# Altium schematic sheet SCH-radio.SchDoc
size A2; Organization: Altium Limited; Address1: L3, 12a Rodborough Rd; Address2: Frenchs Forest; Address3: NSW; Address4: Australia 2086
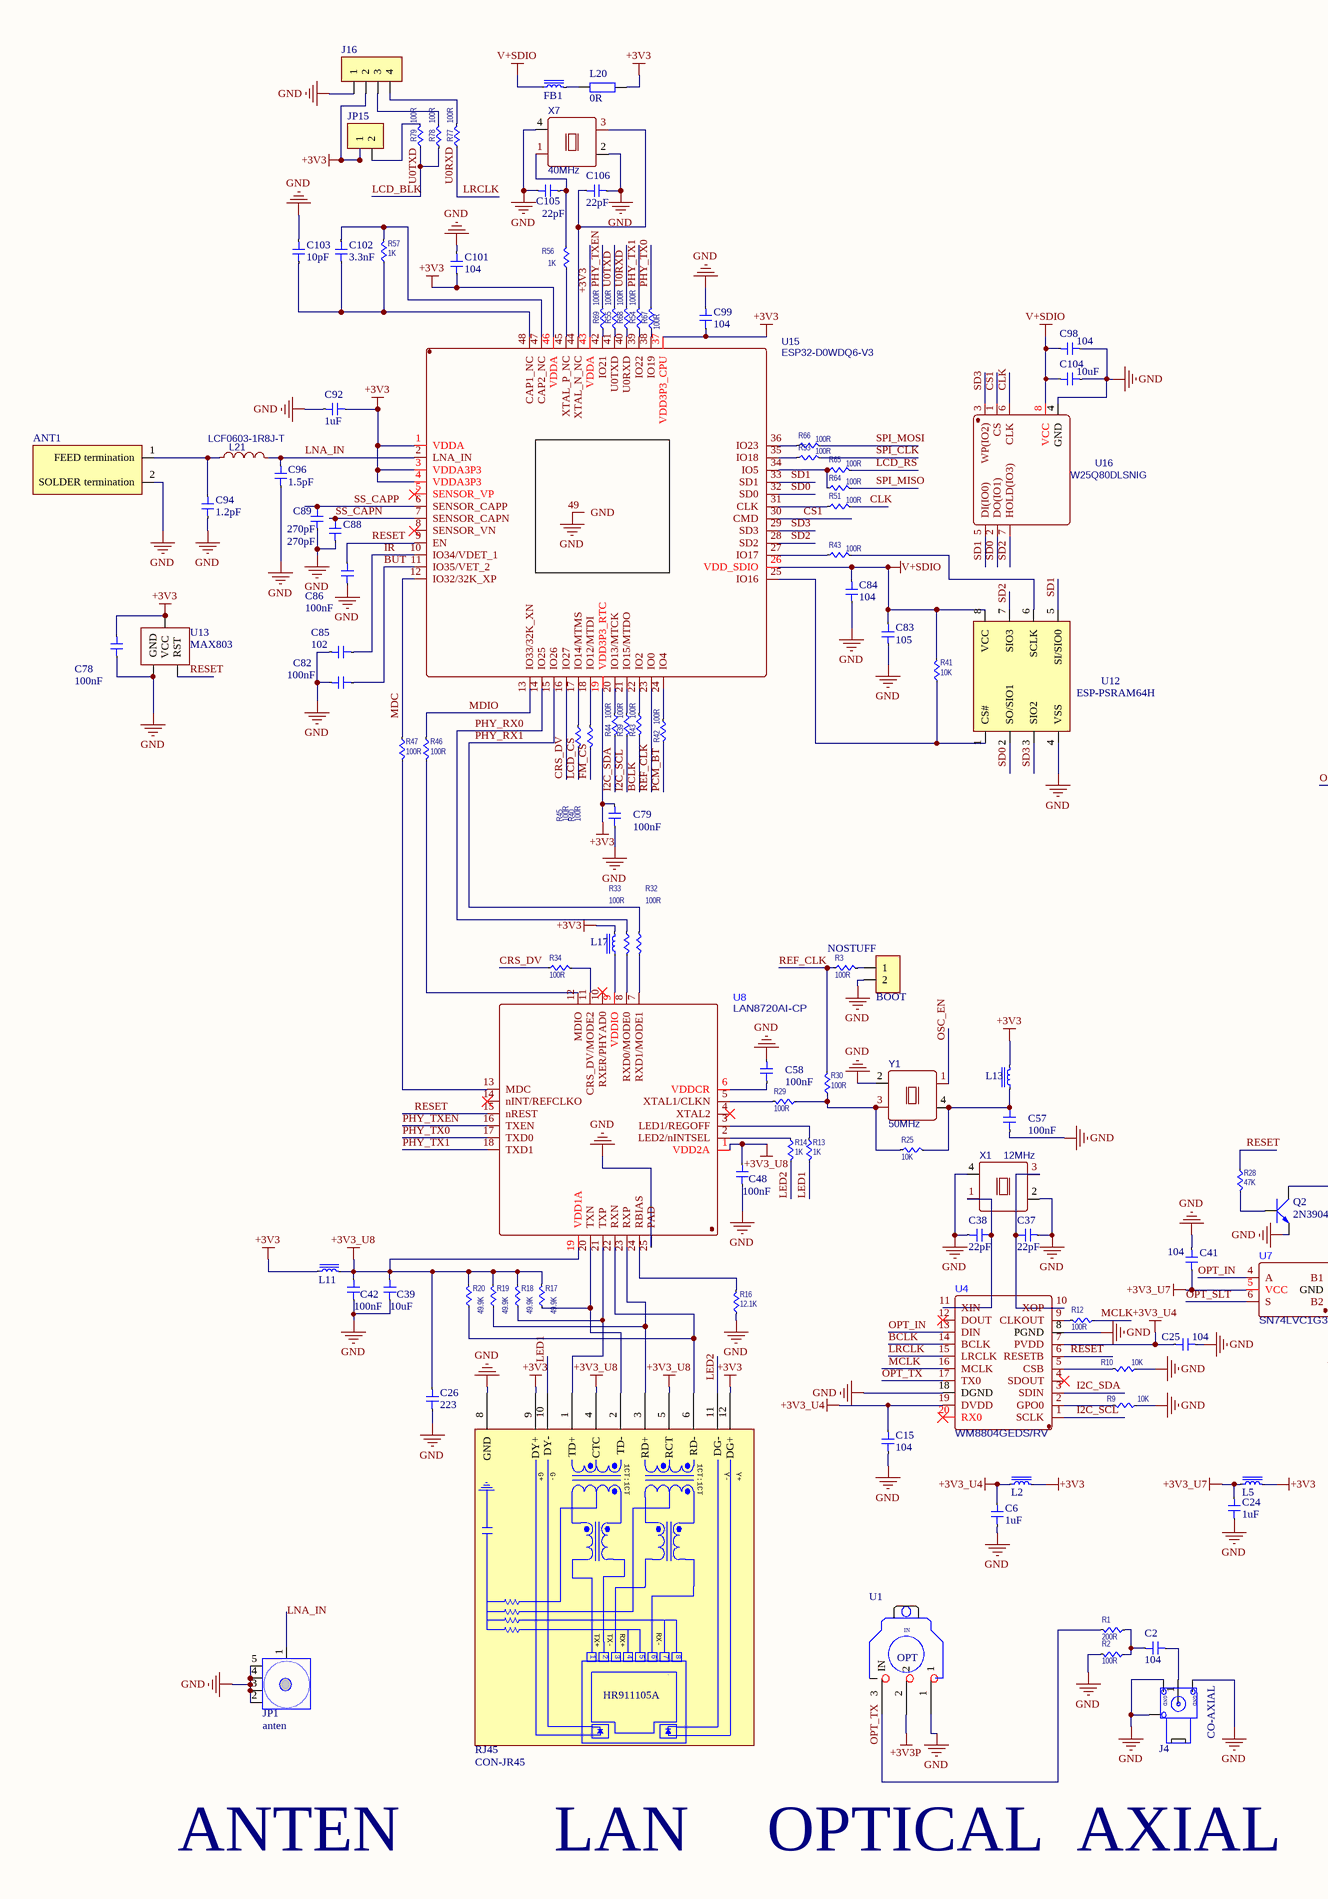
[diagram p0: SCH-radio.SchDoc, left]
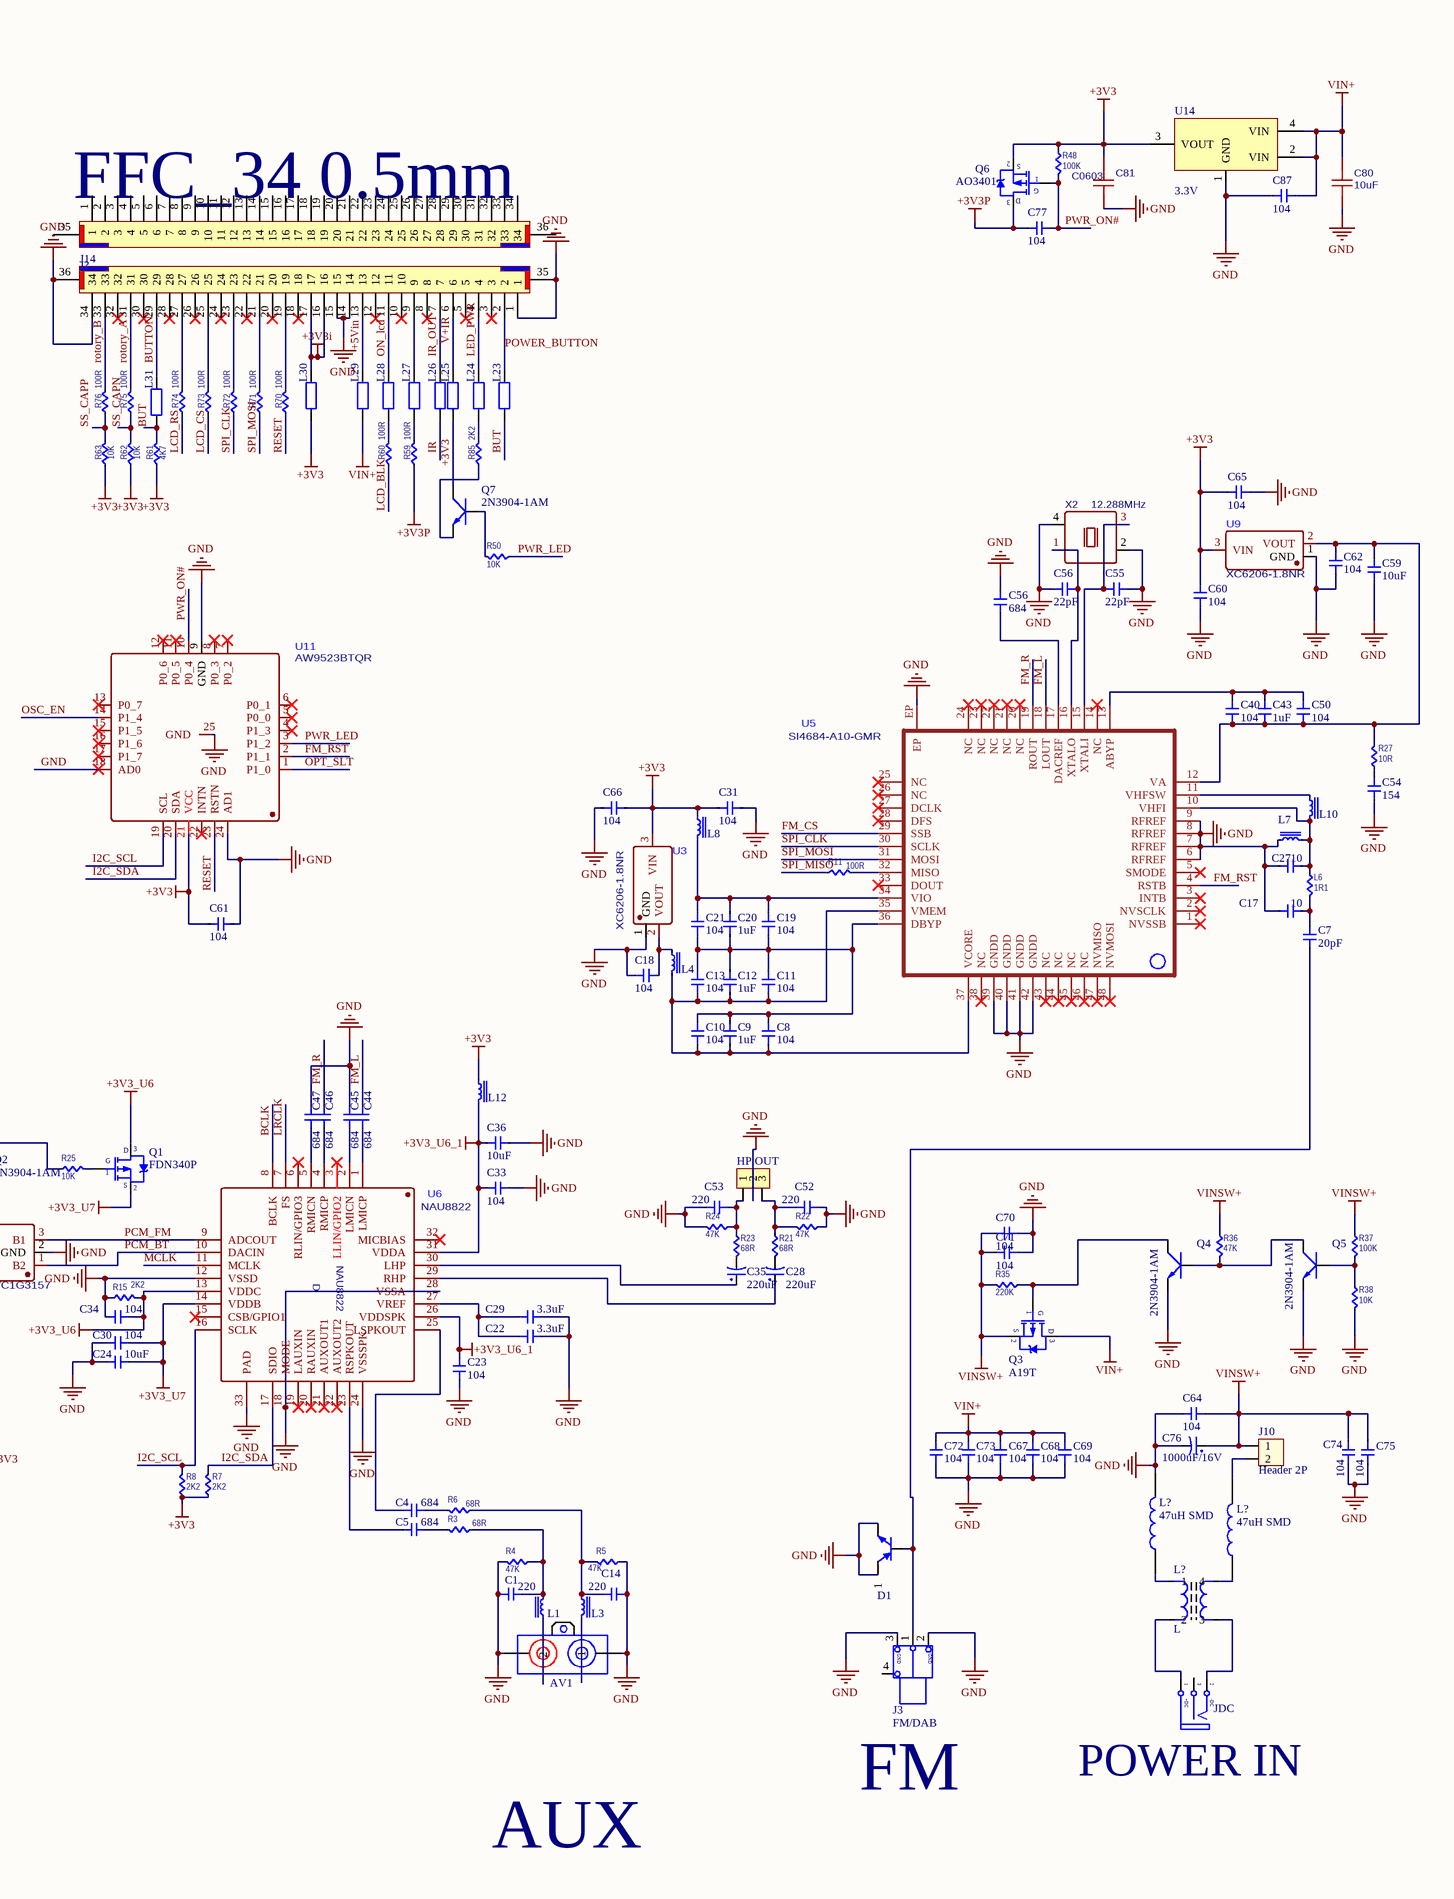
[diagram p1: SCH-radio.SchDoc, right]

## Parts
(Parts that share a designator on the sheet are numbered #1, #2 ... from top to bottom, then left to right.)
ANT1  Rainsun AN2051 2.4GHZ Chip Antenna  [ANTENNA CHIP RAINSUN 2.4GHZ AN2051]  (value not drawn)
AV1  AV2  [AV2 FELMALE DON DUNG_SLIVER NAM]  (value not drawn)
BOOT  JP2 2.54mm  [JP2-D1T]  (value not drawn)
C1  220  [CAP 0402]
C2  104  [CAP 0402]
C4  684  [CAP 0402]
C5  684  [CAP 0402]
C6  1uF  [CAP 0402]
C7  20pF  [CAP 0402]
C8  104  [CAP 0402]
C9  1uF  [CAP 0402]
C10  104  [CAP 0402]
C11  104  [CAP 0402]
C12  1uF  [CAP 0402]
C13  104  [CAP 0402]
C14  220  [CAP 0402]
C15  104  [CAP 0402]
C17  10  [CAP 0402]
C18  104  [CAP 0402]
C19  104  [CAP 0402]
C20  1uF  [CAP 0402]
C21  104  [CAP 0402]
C22  3.3uF  [CAP 0402]
C23  104  [CAP 0402]
C24#1  10uF  [CAP 0402]
C24#2  1uF  [CAP 0402]
C25  104  [CAP 0402]
C26  223  [CAP 0402]
C27  10  [CAP 0402]
C28  220uF  [tu hoa 4mm]
C29  3.3uF  [CAP 0402]
C30  104  [CAP 0402]
C31  104  [CAP 0402]
C33  104  [CAP 0402]
C34  104  [CAP 0402]
C35  220uF  [tu hoa 4mm]
C36  10uF  [CAP 0402]
C37  22pF  [CAP 0402]
C38  22pF  [CAP 0402]
C39  10uF  [CAP 0402]
C40  104  [CAP 0402]
C41  104  [CAP 0402]
C42  100nF  [CAP 0402]
C43  1uF  [CAP 0402]
C44  684  [CAP 0402]
C45  684  [CAP 0402]
C46  684  [CAP 0402]
C47  684  [CAP 0402]
C48  100nF  [CAP 0402]
C50  104  [CAP 0402]
C52  220  [CAP 0402]
C53  220  [CAP 0402]
C54  154  [CAP 0402]
C55  22pF  [CAP 0402]
C56#1  684  [CAP 0402]
C56#2  22pF  [CAP 0402]
C57  100nF  [CAP 0402]
C58  100nF  [CAP 0402]
C59  10uF  [CAP 0402]
C60  104  [CAP 0402]
C61  104  [CAP 0402]
C62  104  [CAP 0402]
C64  104  [CAP 0402]
C65  104  [CAP 0402]
C66  104  [CAP 0402]
C67  104  [CAP 0402]
C68  104  [CAP 0402]
C69  104  [CAP 0402]
C70  104  [CAP 0402]
C71  104  [CAP 0402]
C72  104  [CAP 0402]
C73  104  [CAP 0402]
C74  104  [CAP 0402]
C75  104  [CAP 0402]
C76  1000uF/16V  [tu hoa 10mm]
C77  104  [CAP 0402]
C78  100nF  [CAP 0402]
C79  100nF  [CAP 0402]
C80  10uF  [Tu 0603]
C81  C0603  [Tu 0603]
C82  100nF  [CAP 0402]
C83  105  [CAP 0402]
C84  104  [CAP 0402]
C85  102  [CAP 0402]
C86  100nF  [CAP 0402]
C87  104  [CAP 0402]
C88  270pF  [CAP 0402]
C89  270pF  [CAP 0402]
C92  1uF  [CAP 0402]
C94  1.2pF  [CAP 0402]
C96  1.5pF  [CAP 0402]
C98  104  [CAP 0402]
C99  104  [CAP 0402]
C101  104  [CAP 0402]
C102  3.3nF  [CAP 0402]
C103  10pF  [CAP 0402]
C104  10uF  [CAP 0402]
C105  22pF  [CAP 0402]
C106  22pF  [CAP 0402]
D1  DIODE A7  [SOT23]  (value not drawn)
FB1  FERRITE BEAD 1 KOHM 0402 1LN  [IND 0402]  (value not drawn)
HP_OUT  XH3P-2.54mm  [XH3P-2.54mm]  (value not drawn)
J3  FM/DAB  [TRC-005]
J4  CO-AXIAL  [TRC-005]
J10  Header 2P  [Header_Duc Cong_2P 2.54 T]
J14  0.5mm 34P H  [FPC-0.5MM-34P-H2.0]  (value not drawn)
J16  JP4 2.54mm  [JP4-D1T]  (value not drawn)
J?  0.5mm 34P H  [FPC-0.5MM-34P-H2.0]  (value not drawn)
JDC  Jack DC5.5x2.1  [DC-IN]  (value not drawn)
JP1  anten  [SMA_UFL HOLE]
JP15  JP2 2.54mm  [JP2-D1T]  (value not drawn)
L1  FERRITE BEAD 1 KOHM 0402 1LN  [IND 0402]  (value not drawn)
L2  FERRITE BEAD 1 KOHM 0402 1LN  [IND 0402]  (value not drawn)
L3  FERRITE BEAD 1 KOHM 0402 1LN  [IND 0402]  (value not drawn)
L4  FERRITE BEAD 1 KOHM 0402 1LN  [IND 0402]  (value not drawn)
L5  FERRITE BEAD 1 KOHM 0402 1LN  [IND 0402]  (value not drawn)
L6  1R1  [RES 0402]
L7  FERRITE BEAD 1 KOHM 0402 1LN  [IND 0402]  (value not drawn)
L8  FERRITE BEAD 1 KOHM 0402 1LN  [IND 0402]  (value not drawn)
L10  FERRITE BEAD 1 KOHM 0402 1LN  [IND 0402]  (value not drawn)
L11  FERRITE BEAD 1 KOHM 0402 1LN  [IND 0402]  (value not drawn)
L12  FERRITE BEAD 1 KOHM 0402 1LN  [IND 0402]  (value not drawn)
L13  FERRITE BEAD 1 KOHM 0402 1LN  [IND 0402]  (value not drawn)
L17  FERRITE BEAD 1 KOHM 0402 1LN  [IND 0402]  (value not drawn)
L20  0R  [tro smd 0603]
L21  LCF0603-1R8J-T  [L 0603]
L23  mH  [tro smd 0603]  (value not drawn)
L24  mH  [tro smd 0603]  (value not drawn)
L25  mH  [tro smd 0603]  (value not drawn)
L26  mH  [tro smd 0603]  (value not drawn)
L27  mH  [tro smd 0603]  (value not drawn)
L28  mH  [tro smd 0603]  (value not drawn)
L29  mH  [tro smd 0603]  (value not drawn)
L30  mH  [tro smd 0603]  (value not drawn)
L31  mH  [tro smd 0603]  (value not drawn)
L?#1  47uH SMD  [L 1206]
L?#2  47uH SMD  [L 1206]
L?#3  L  [L 1A 7X8]
Q1  FDN340P  [SOT23 MOSFET P]
Q2  2N3904-1AM  [SOT23BCE]
Q3  A19T  [SOT23 MOSFET P]
Q4  2N3904-1AM  [SOT23BCE]
Q5  2N3904-1AM  [SOT23BCE]
Q6  AO3401  [SOT23 MOSFET P]
Q7  2N3904-1AM  [SOT23BCE]
R1  200R  [RES 0402]
R2  100R  [RES 0402]
R3#1  100R  [RES 0402]
R3#2  68R  [RES 0402]
R4  47K  [RES 0402]
R5  47K  [RES 0402]
R6  68R  [RES 0402]
R7  2K2  [RES 0402]
R8  2K2  [RES 0402]
R9  10K  [RES 0402]
R10  10K  [RES 0402]
R11  100R  [RES 0402]
R12  100R  [RES 0402]
R13  1K  [RES 0402]
R14  1K  [RES 0402]
R15  2K2  [RES 0402]
R16  12.1K  [RES 0402]
R17  49.9K  [RES 0402]
R18  49.9K  [RES 0402]
R19  49.9K  [RES 0402]
R20  49.9K  [RES 0402]
R21  68R  [RES 0402]
R22  47K  [RES 0402]
R23  68R  [RES 0402]
R24  47K  [RES 0402]
R25#1  10K  [RES 0402]
R25#2  10K  [RES 0402]
R27  10R  [RES 0402]
R28  47K  [RES 0402]
R29  100R  [RES 0402]
R30  100R  [RES 0402]
R32  100R  [RES 0402]
R33  100R  [RES 0402]
R34  100R  [RES 0402]
R35  220K  [RES 0402]
R36  47K  [RES 0402]
R37  100K  [RES 0402]
R38  10K  [RES 0402]
R39  100R  [RES 0402]
R40  100R  [RES 0402]
R41  10K  [RES 0402]
R42  100R  [RES 0402]
R43#1  100R  [RES 0402]
R43#2  100R  [RES 0402]
R44  100R  [RES 0402]
R45  100R  [RES 0402]
R46  100R  [RES 0402]
R47  100R  [RES 0402]
R48  100K  [RES 0402]
R50  10K  [RES 0402]
R51  100R  [RES 0402]
R53  100R  [RES 0402]
R54  100R  [RES 0402]
R55  100R  [RES 0402]
R56  1K  [RES 0402]
R57  1K  [RES 0402]
R59  100R  [RES 0402]
R60  100R  [RES 0402]
R61  4K7  [RES 0402]
R62  10K  [RES 0402]
R63  10K  [RES 0402]
R64  100R  [RES 0402]
R65  100R  [RES 0402]
R66  100R  [RES 0402]
R67  100R  [RES 0402]
R68  100R  [RES 0402]
R69  100R  [RES 0402]
R70  100R  [RES 0402]
R71  100R  [RES 0402]
R72  100R  [RES 0402]
R73  100R  [RES 0402]
R74  100R  [RES 0402]
R75  100R  [RES 0402]
R76  100R  [RES 0402]
R77  100R  [RES 0402]
R78  100R  [RES 0402]
R79  100R  [RES 0402]
R85  2K2  [RES 0402]
RJ45  CON-JR45  [CON JR45]
U1  OPTICAL IN  [OPTICAL TOTX147AL(F,T)]  (value not drawn)
U3  XC6206-1.8NR  [SOT-23-3_L2.9-W1.3-P0.95-LS2.4-BR]
U4  WM8804GEDS/RV  [SSOP-20_L7.2-W5.3-P0.65-LS7.8-BL]
U5  SI4684-A10-GMR  [48-VFQFN (7X7) EXPOSED PAD]
U6  NAU8822  [HVQFN-32_L5.0-W5.0-P0.50-BL-EP]
U7  SN74LVC1G3157  [SOT 23- 6]
U8  LAN8720AI-CP  [QFN24]
U9  XC6206-1.8NR  [SOT-23-3_L2.9-W1.3-P0.95-LS2.4-BR]
U11  AW9523BTQR  [TQFN-24_L4.0-W4.0-P0.50-TL-EP]
U12  ESP-PSRAM64H  [SOP-8]
U13  MAX803  [SOT23BCE]
U14  3.3V  [SOT89-150P410X160-3N]
U15  ESP32-D0WDQ6-V3  [QFN-48_L7.0-W7.0-P0.50-BL-EP5.1]
U16  W25Q80DLSNIG  [SOP-8]
X1  12MHz  [Crystal 4SMD 32x25MM]
X2  12.288MHz  [Crystal 4SMD 32x25MM]
X7  40MHz  [Crystal 4SMD 32x25MM]
Y1  50MHz  [Crystal 4SMD 32x25MM]

## Nets
+3V3: C31.1 C60.2 C61.2 C65.1 C66.2 C78.1 C79.2 C81.2 C92.2 C99.1 C101.2 J16.2 JP15.1 L2.2 L5.2 L8.1 L11.1 L12.1 L13.2 L17.2 L20.2 L25.1 L30.1 Q6.2(S) Q7.2(C) R7.1 R8.1 R48.1 R61.1 R62.1 R63.1 RJ45.9(DY+) RJ45.12(DG+) U3.3(VIN) U9.3(VIN) U11.21(VCC) U13.2(VCC) U14.3(VOUT) U15.1(VDDA) U15.3(VDDA3P3) U15.4(VDDA3P3) U15.19(VDD3P3_RTC) U15.37(VDD3P3_CPU) U15.43(VDDA) U15.46(VDDA)
+3V3_U4: C6.2 C15.2 C25.1 L2.1 U4.7(PVDD) U4.19(DVDD)
+3V3_U6: C34.1 Q1.3(D) R15.2 U6.13(VDDC)
+3V3_U6_1: C23.1 C33.2 C36.2 L12.2 U6.26(VDDSPK) U6.31(VDDA)
+3V3_U7: C24#1.1 C24#2.2 C30.1 C41.2 L5.1 Q1.2(S) U6.14(VDDB) U7.5(VCC)
+3V3_U8: C26.2 C39.2 C42.2 C48.2 L11.2 R17.2 R18.2 R19.2 R20.2 RJ45.4(CTC) RJ45.5(RCT) U8.1(VDD2A) U8.19(VDD1A)
+3V3i: J14.16 J14.17 L30.2
+3V3P: C77.2 Q6.3(D) R59.1 U1.2
GND: ANT1.2(SOLDER_termination) AV1.3 AV1.4 BOOT.2 C1.2 C6.1 C14.1 C15.1 C17.1 C18.1 C22.1 C23.2 C24#1.2 C24#2.1 C25.2 C26.1 C27.1 C29.1 C30.2 C31.2 C33.1 C34.2 C36.1 C37.1 C38.2 C39.1 C41.1 C42.1 C45.1 C47.1 C48.1 C52.1 C53.2 C54.1 C55.1 C56#1.1 C56#2.2 C57.1 C58.2 C59.1 C60.1 C61.1 C62.1 C64.2 C65.2 C66.1 C67.2 C68.2 C69.2 C70.1 C71.1 C72.2 C73.2 C74.1 C75.1 C76.2 C78.2 C79.1 C80.1 C81.1 C82.1 C83.2 C84.2 C85.1 C86.2 C87.2 C88.2 C89.2 C92.1 C94.1 C96.1 C98.2 C99.2 C101.1 C103.1 C104.2 C105.2 C106.1 D1.2(C) HP_OUT.2 J3.2(Yellow) J3.3(White) J4.2(Yellow) J4.3(White) J4.4(Red) J14.1 J14.14 J14.15 J14.34 J14.35 J14.36 J16.1 JP1.2 JP1.3 JP1.4 JP1.5 L7.1 L?#1.2 Q2.3(E) Q4.3(E) Q5.3(E) R2.2 R4.2 R5.1 R9.1 R10.1 R15.1 R16.1 R22.1 R24.2 R38.2 RJ45.8(GND) U1.1 U3.1(GND) U4.8(PGND) U4.18(DGND) U5.6(RFREF) U5.7(RFREF) U5.8(RFREF) U5.9(RFREF) U5.39(GNDD) U5.40(GNDD) U5.41(GNDD) U5.42(GNDD) U5.EP U6.12(VSSD) U6.18(MODE) U6.24(VSSSPK) U6.28(VSSA) U6.33(PAD) U7.2(GND) U8.25(PAD) U9.1(GND) U11.9(GND) U11.18(AD0) U11.24(AD1) U11.25(GND) U12.4(VSS) U13.1(GND) U14.1(GND) U15.49(GND) U16.4(GND) X1.2(GND) X1.4(VCC) X2.2(GND) X2.4(VCC) X7.2(GND) X7.4(VCC) Y1.2(GND)
V+SDIO: C83.1 C84.1 C98.1 C104.1 FB1.1 R41.2 U12.8(VCC) U15.26(VDD_SDIO) U16.8(VCC)
VIN+: C67.1 C68.1 C69.1 C72.1 C73.1 C80.2 C87.1 L29.1 Q3.3(D) U14.2(VIN) U14.4(VIN)
VINSW+: C64.1 C70.2 C71.2 C74.2 C75.2 C76.1 J10.1 Q3.2(S) R35.2 R36.1 R37.1
+5Vin: J14.13 L29.2
BCLK: R43#2.2 U4.14(BCLK) U6.8(BCLK)
BUT: C82.2 L23.1 L31.1 R61.2 U15.11(IO35/VET_2)
BUTTON: J14.29 L31.2
CLK: R51.2 U16.6(CLK)
CRS_DV: R34.1 U15.16(IO27)
CS1: U15.30(CMD) U16.1(CS)
FM_CS: R40.2 U5.29(SSB)
FM_L: C44.1 U5.18(LOUT)
FM_R: C46.1 U5.19(ROUT)
FM_RST: U5.4(RSTB) U11.2(P1_1)
I2C_SCL: R8.2 R39.2 U4.1(SCLK) U6.16(SCLK) U11.19(SCL)
I2C_SDA: R7.2 R44.2 U4.3(SDIN) U6.17(SDIO) U11.20(SDA)
IR: C85.2 L26.1 U15.10(IO34/VDET_1)
IR_OUT: J14.7 L26.2
LCD_BLK: R55.2 R60.1 R78.1 R79.1  [also labelled U0TXD]
LCD_CS: R45.2 R73.1
LCD_RS: R65.2 R74.1
LED1: R13.2 RJ45.10(DY-)
LED2: R14.2 RJ45.11(DG-)
LED_PWR: J14.4 L24.2
LNA_IN: C96.2 JP1.1 L21.2 U15.2(LNA_IN)
LRCLK: R68.2 R77.1 U4.15(LRCLK) U6.7(FS)  [also labelled U0RXD]
MCLK: R12.1 U4.16(MCLK) U6.11(MCLK)
MDC: R47.1 U15.12(IO32/32K_XP)
MDIO: R46.1 U15.13(IO33/32K_XN)
ON_lcd: J14.11 L28.2
OPT_IN: U4.13(DIN) U7.4(A)
OPT_SLT: U7.6(S) U11.1(P1_0)
OPT_TX: R1.2 U1.3(IN) U4.17(TX0)
OSC_EN: U11.14(P1_4) Y1.1(tri)
PCM_BT: R42.2 U6.10(DACIN) U7.1(B2)
PCM_FM: U6.9(ADCOUT) U7.3(B1)
PHY_RX0: R33.1 U15.14(IO25)
PHY_RX1: R32.1 U15.15(IO26)
PHY_TX0: R67.2 U8.17(TXD0)
PHY_TX1: R54.2 U8.18(TXD1)
PHY_TXEN: R69.2 U8.16(TXEN)
POWER_BUTTON: J14.2 L23.2
PWR_LED: R50.1 U11.3(P1_2)
PWR_ON#: C77.1 Q6.1(G) R48.2 U11.10(P0_4)
REF_CLK: R3#1.1 R30.2 U15.23(IO0)
RESET: C86.1 R28.1 R70.1 U4.6(RESETB) U8.15(nREST) U11.23(RSTN) U13.3(RST) U15.9(EN)
rotory_A: J14.31 R75.2
rotory_B: J14.33 R76.2
SD0: U12.2(SO/SIO1) U15.32(SD0) U16.2(DO(IO1))
SD1: U12.5(SI/SIO0) U15.33(SD1) U16.5(DI(IO0))
SD2: U12.7(SIO3) U15.28(SD2) U16.7(HOLD(IO3))
SD3: U12.3(SIO2) U15.29(SD3) U16.3(WP(IO2))
SPI_CLK: R53.2 R72.1 U5.30(SCLK)
SPI_MISO: R11.1 R64.2
SPI_MOSI: R66.2 R71.1 U5.31(MOSI)
SS_CAPN: C88.1 R62.2 R75.1 U15.7(SENSOR_CAPN)
SS_CAPP: C89.1 R63.2 R76.1 U15.6(SENSOR_CAPP)
V+IR: J14.6 L25.2
NetANT1_1: ANT1.1(FEED_termination) C94.2 L21.1
NetAV1_1: AV1.1 L3.2
NetAV1_2: AV1.2 L1.1
NetBOOT_1: BOOT.1 R3#1.2
NetC1_1: C1.1 L1.2 R3#2.1 R4.1
NetC2_1: C2.1 J4.1(Black)
NetC2_2: C2.2 R1.1 R2.1
NetC4_1: C4.1 R6.2
NetC4_2: C4.2 U6.25(LSPKOUT)
NetC5_1: C5.1 R3#2.2
NetC5_2: C5.2 U6.23(RSPKOUT)
NetC7_1: C7.1 D1.3(E) J3.1(Black)
NetC7_2: C7.2 C17.2 L6.2
NetC8_1: C8.1 C9.1 C10.1 C11.1 C12.1 C13.1 C19.2 C20.2 C21.2 U5.36(DBYP)
NetC8_2: C8.2 C9.2 C10.2 C11.2 C12.2 C13.2 L4.2 U5.35(VMEM) U5.37(VCORE)
NetC14_2: C14.2 L3.1 R5.2 R6.1
NetC18_2: C18.2 L4.1 U3.2(VOUT)
NetC19_1: C19.1 C20.1 C21.1 L8.2 U5.34(VIO)
NetC22_2: C22.2 C29.2 U6.27(VREF)
NetC27_2: C27.2 L6.1 L7.2 L10.2 U5.10(VHFI)
NetC28_1: C28.1 U6.29(RHP)
NetC28_2: C28.2 R21.2
NetC35_1: C35.1 U6.30(LHP)
NetC35_2: C35.2 R23.2
NetC37_2: C37.2 U4.10(XOP) X1.3(OUT)
NetC38_1: C38.1 U4.11(XIN) X1.1(tri)
NetC40_1: C40.1 C43.1 C50.1 U5.13(ABYP)
NetC40_2: C40.2 C43.2 C50.2 C59.2 C62.2 R27.2 U5.12(VA) U9.2(VOUT)
NetC44_2: C44.2 U6.1(LMICP)
NetC45_2: C45.2 U6.2(LMICN)
NetC46_2: C46.2 U6.4(RMICP)
NetC47_2: C47.2 U6.5(RMICN)
NetC52_2: C52.2 HP_OUT.3 R21.1 R22.2
NetC53_1: C53.1 HP_OUT.1 R23.1 R24.1
NetC54_2: C54.2 R27.1
NetC55_2: C55.2 U5.15(XTALI) X2.3(OUT)
NetC56#1_2: C56#1.2 U5.17(DACREF)
NetC56#2_1: C56#2.1 U5.16(XTALO) X2.1(tri)
NetC57_2: C57.2 L13.1 R25#1.2 Y1.4(VCC)
NetC58_1: C58.1 U8.6(VDDCR)
NetC102_1: C102.1 R57.2 U15.47(CAP2_NC)
NetC102_2: C102.2 C103.2 R57.1 U15.48(CAP1_NC)
NetC105_1: C105.1 R56.2 X7.1(tri)
NetC106_2: C106.2 U15.44(XTAL_N_NC) X7.3(OUT)
NetFB1_2: FB1.2 L20.1
NetJ10_2: J10.2 L?#2.2
NetJ14_9: J14.9 L27.2
NetJ14_19: J14.19 R70.2
NetJ14_21: J14.21 R71.2
NetJ14_23: J14.23 R72.2
NetJ14_25: J14.25 R73.2
NetJ14_27: J14.27 R74.2
NetJ16_3: J16.3 R78.2
NetJ16_4: J16.4 R77.2
NetJDC_1: JDC.1(T) L?#3.2
NetJDC_2: JDC.2(TN) L?#3.3
NetJP15_2: JP15.2 R79.2
NetL10_1: L10.1 U5.11(VHFSW)
NetL17_1: L17.1 U8.9(VDDIO)
NetL24_1: L24.1 R85.2
NetL27_1: L27.1 R59.2
NetL28_1: L28.1 R60.2
NetL?#1_1: L?#1.1 L?#3.1
NetL?#2_1: L?#2.1 L?#3.4
NetQ1_1: Q1.1(G) R25#2.2
NetQ2_1: Q2.1(B) R28.2
NetQ2_2: Q2.2(C) R25#2.1
NetQ3_1: Q3.1(G) Q4.2(C) R35.1
NetQ4_1: Q4.1(B) Q5.2(C) R36.2
NetQ5_1: Q5.1(B) R37.2 R38.1
NetQ7_1: Q7.1(B) R50.2
NetQ7_3: Q7.3(E) R85.1
NetR9_2: R9.2 U4.2(GPO0)
NetR10_2: R10.2 U4.5(CSB)
NetR11_2: R11.2 U5.32(MISO)
NetR12_2: R12.2 U4.9(CLKOUT)
NetR13_1: R13.1 U8.3(LED1/REGOFF)
NetR14_1: R14.1 U8.2(LED2/nINTSEL)
NetR16_2: R16.2 U8.24(RBIAS)
NetR17_1: R17.1 RJ45.2(TD-) U8.20(TXN)
NetR18_1: R18.1 RJ45.1(TD+) U8.21(TXP)
NetR19_1: R19.1 RJ45.3(RD+) U8.23(RXP)
NetR20_1: R20.1 RJ45.6(RD-) U8.22(RXN)
NetR25#1_1: R25#1.1 R29.1 R30.1 Y1.3(OUT)
NetR29_2: R29.2 U8.5(XTAL1/CLKN)
NetR32_2: R32.2 U8.7(RXD1/MODE1)
NetR33_2: R33.2 U8.8(RXD0/MODE0)
NetR34_2: R34.2 U8.11(CRS_DV/MODE2)
NetR39_1: R39.1 U15.21(IO15/MTDO)
NetR40_1: R40.1 U15.18(IO12/MTDI)
NetR41_1: R41.1 U12.1(CS#) U15.25(IO16)
NetR42_1: R42.1 U15.24(IO4)
NetR43#1_1: R43#1.1 U15.27(IO17)
NetR43#1_2: R43#1.2 U12.6(SCLK)
NetR43#2_1: R43#2.1 U15.22(IO2)
NetR44_1: R44.1 U15.20(IO13/MTCK)
NetR45_1: R45.1 U15.17(IO14/MTMS)
NetR46_2: R46.2 U8.12(MDIO)
NetR47_2: R47.2 U8.13(MDC)
NetR51_1: R51.1 U15.31(CLK)
NetR53_1: R53.1 U15.35(IO18)
NetR54_1: R54.1 U15.39(IO22)
NetR55_1: R55.1 U15.41(U0TXD)
NetR56_1: R56.1 U15.45(XTAL_P_NC)
NetR64_1: R64.1 R65.1 U15.34(IO5)
NetR66_1: R66.1 U15.36(IO23)
NetR67_1: R67.1 U15.38(IO19)
NetR68_1: R68.1 U15.40(U0RXD)
NetR69_1: R69.1 U15.42(IO21)

Not connected (* = marked no-connect by the designer): D1 1; J3 4(Red); J14 3* 5* 8* 10* 12* 18* 20* 22* 24* 26* 28* 30* 32*; J? 1 2 3 4 5 6 7 8 9 10 11 12 13 14 15 16 17 18 19 20 21 22 23 24 25 26 27 28 29 30 31 32 33 34 35 36; JDC 3(S); U4 4(SDOUT)* 12(DOUT)* 20(RX0)*; U5 1(NVSSB)* 2(NVSCLK)* 3(INTB)* 5(SMODE)* 14(NC)* 20(NC)* 21(NC)* 22(NC)* 23(NC)* 24(NC)* 25(NC)* 26(NC)* 27(DCLK)* 28(DFS)* 33(DOUT)* 38(NC)* 43(NC)* 44(NC)* 45(NC)* 46(NC)* 47(NVMISO)* 48(NVMOSI)*; U6 3(LLIN/GPIO2)* 6(RLIN/GPIO3)* 15(CSB/GPIO1)* 19(LAUXIN)* 20(RAUXIN)* 21(AUXOUT1)* 22(AUXOUT2)* 32(MICBIAS)*; U8 4(XTAL2)* 10(RXER/PHYAD0)* 14(nINT/REFCLKO)*; U11 4(P1_3)* 5(P0_0)* 6(P0_1)* 7(P0_2)* 8(P0_3)* 11(P0_5)* 12(P0_6)* 13(P0_7)* 15(P1_5)* 16(P1_6)* 17(P1_7)* 22(INTN)*; U15 5(SENSOR_VP)* 8(SENSOR_VN)*

## Notes on the sheet
- (near J?) FFC_34 0.5mm
- NOSTUFF
- FM
- (near JDC) POWER IN
- ANTEN
- LAN
- OPTICAL
- AXIAL
- AUX
- Title
- Size:
- Date:
- File:
- A2
- Number:
- Time:
- Revision:
- Sheet
- of
- (in symbol AXIAL) GND
- (in symbol FM/DAB) GND
- (in symbol Jac_DC) +DC; -DC
- (in symbol JR45-ethernet) 1CT:1CT; G+; G-; Y-; Y+; RX-; TX+; TX-; RX+; 7; HR911105A
- (in symbol NAU8822) D
- (in symbol OPTICAL TORX147L) OPT

## Library data of the parts
ANT1 = ANTENNA CHIP 2.4GHZ AN2051: C99727 extend; Manufacturer Part Number: AN2051; LINK: http://www.rainsun.com/wp-content/uploads/2018/07/RainSun-AN2051.pdf; Manufacturer: RAINSUN
AV1 = AV2 FEMALE
BOOT JP15 = JP2: WR-PHD 2.54 mm Angled Socket Header; Manufacturer: W¨¹rth Elektronik eiSos GmbH; partNo: 613002143121; ComponentLink1 Description: Manufacturer; ComponentLink2 Description: Datasheet; NoPins: 02; Created Date: 29 March 2013; ComponentLink1URL: http://www.we-online.com; ComponentLink2URL: http://katalog.we-online.de/em/datasheet/6130xx143121.pdf; Created by: Karrer Zheng
C1 C2 C4-C15 C17-C23 C24#1 C24#2 C27 C29-C31 C33 C34 C36 C40 C43-C47 C50 C52-C54 C59 C60 C62 C65-C75 C83 C84 C98 C104 = CAP CER 12pF 50V 0402: C1550; Manufacturer: Murata Electronics North America; Manufacturer Part Number: GRM1555C1H120JA01D; Tolerance: ±5%; Voltage - Rated: 50V; Temperature Coefficient: C0G, NP0; Notification: Current market demand for these product types have resulted in fluctuating and extending lead times. Lead times may differ.; Supplier 1: Digi-Key; Supplier Part Number 1: 490-5924-1-ND; RoHS: RoHS Compliant; Category: Capacitors; Stock: 100000; Pricing: 1=0.1, 10=0.036, 100=0.0162, 500=0.0116, 1000=0.00911, 2500=0.00828, 5000=0.00762 (USD); Packaging: Cut Tape (CT); Part Status: Not For New Designs; Operating Temperature: -55°C ~ 125°C; Features: -; Ratings: -; Applications: General Purpose; Mounting Type: Surface Mount, MLCC; Package / Case: 0402 (1005 Metric); Size / Dimension: 0.039" L x 0.020" W (1.00mm x 0.50mm); Height - Seated (Max): -; Thickness (Max): 0.022" (0.55mm); Lead Spacing: -; Lead Style: -; ComponentLink1URL: https://www.murata.com/~/media/webrenewal/support/library/catalog/products/capacitor/mlcc/c02e.ashx?la=en-us; ComponentLink1Description: https://www.murata.com/~/media/webrenewal/support/library/catalog/products/capacitor/mlcc/c02e.ashx?la=en-us
C25 C41 C61 C64 C77 C87 = CAP CER 12pF 50V 0402: CAP CER 12PF 50V NP0 0402; Manufacturer: Murata Electronics North America; Manufacturer Part Number: GRM1555C1H120JA01D; Tolerance: ±5%; Temperature Coefficient: C0G, NP0; Notification: Current market demand for these product types have resulted in fluctuating and extending lead times. Lead times may differ.; Supplier 1: Digi-Key; Supplier Part Number 1: 490-5924-1-ND; RoHS: RoHS Compliant; Category: Capacitors; Stock: 100000; Pricing: 1=0.1, 10=0.036, 100=0.0162, 500=0.0116, 1000=0.00911, 2500=0.00828, 5000=0.00762 (USD); Packaging: Cut Tape (CT); Part Status: Not For New Designs; Voltage - Rated: 50V; Operating Temperature: -55°C ~ 125°C; Features: -; Ratings: -; Applications: General Purpose; Mounting Type: Surface Mount, MLCC; Package / Case: 0402 (1005 Metric); Size / Dimension: 0.039" L x 0.020" W (1.00mm x 0.50mm); Height - Seated (Max): -; Thickness (Max): 0.022" (0.55mm); Lead Spacing: -; Lead Style: -; ComponentLink1URL: https://www.murata.com/~/media/webrenewal/support/library/catalog/products/capacitor/mlcc/c02e.ashx?la=en-us; ComponentLink1Description: https://www.murata.com/~/media/webrenewal/support/library/catalog/products/capacitor/mlcc/c02e.ashx?la=en-us
C26 C39 C42 C48 C57 C58 C78 C79 C82 C85 C86 C88 C89 = CAP CER 0.1UF 16V 0402: C301975 Extend; Manufacturer: Murata Electronics North America; Manufacturer Part Number: GRM155R71C104KA88D; Capacitance: 0.10µF; Tolerance: ±10%; Voltage - Rated: 16V; Temperature Coefficient: X7R; Supplier 1: Digi-Key; RoHS: RoHS Compliant; Category: Capacitors; Stock 1: 22029292; Pricing 1: 1=0.1, 10=0.012, 50=0.0066, 100=0.0055, 250=0.00452, 500=0.00386, 1000=0.003, 5000=0.0025 (USD); Packaging: Cut Tape (CT); Mounting Type: Surface Mount, MLCC; Operating Temperature: -55°C ~ 125°C; Applications: General Purpose; Ratings: -; Package / Case: 0402 (1005 Metric); Size / Dimension: 0.039" L x 0.020" W (1.00mm x 0.50mm); Height - Seated (Max): -; Thickness (Max): 0.022" (0.55mm); Lead Spacing: -; Features: -; Lead Style: -; ComponentLink1URL: http://www.murata.com/~/media/webrenewal/support/library/catalog/products/capacitor/mlcc/c02e.pdf; ComponentLink1Description: http://www.murata.com/~/media/webrenewal/support/library/catalog/products/capacitor/mlcc/c02e.pdf; Supplier Part Number 1: 490-3261-1-ND; Part Status: Active
C28 C35 = Tu 4x7mm: Cắm; Ten_Linh_Kien: Tụ Hóa 2.2uF 50V 4x7MM; Don_Vi: Con; So_Chan: 2; Ma_Hang: MH001356; Chung_Loai: Cắm; Kieu_Chan: *
C37 C38 C55 C56#1 C56#2 C92 C99 C101-C103 C105 C106 = CAP CER 12pF 50V 0402: C1555; Manufacturer: Murata Electronics North America; Manufacturer Part Number: GRM1555C1H120JA01D; Tolerance: ±5%; Voltage - Rated: 50V; Temperature Coefficient: C0G, NP0; Notification: Current market demand for these product types have resulted in fluctuating and extending lead times. Lead times may differ.; Supplier 1: Digi-Key; Supplier Part Number 1: 490-5924-1-ND; RoHS: RoHS Compliant; Category: Capacitors; Stock: 100000; Pricing: 1=0.1, 10=0.036, 100=0.0162, 500=0.0116, 1000=0.00911, 2500=0.00828, 5000=0.00762 (USD); Packaging: Cut Tape (CT); Part Status: Not For New Designs; Operating Temperature: -55°C ~ 125°C; Features: -; Ratings: -; Applications: General Purpose; Mounting Type: Surface Mount, MLCC; Package / Case: 0402 (1005 Metric); Size / Dimension: 0.039" L x 0.020" W (1.00mm x 0.50mm); Height - Seated (Max): -; Thickness (Max): 0.022" (0.55mm); Lead Spacing: -; Lead Style: -; ComponentLink1URL: https://www.murata.com/~/media/webrenewal/support/library/catalog/products/capacitor/mlcc/c02e.ashx?la=en-us; ComponentLink1Description: https://www.murata.com/~/media/webrenewal/support/library/catalog/products/capacitor/mlcc/c02e.ashx?la=en-us
C76 = Tu 10x15mm: Cắm; So_Chan: 2; Don_Vi: Con; Ten_Linh_Kien: Tụ Hóa 6.8uF 350V 10x15MM; Ma_Hang: MH004800; Chung_Loai: Cắm; Kieu_Chan: *
C80 C81 = C 0603: BOM_Manufacturer: Murata Electronics; BOM_Manufacturer Part: GRM1885C1H1R5CA01D; nameAlias: Capacitance; Contributor: LCSC; BOM_Supplier: LCSC; BOM_Supplier Part: C143017; spicePre: C; spiceSymbolName: GRM1885C1H1R5CA01D
C94 C96 = CAP CER 0.1UF 16V 0402: C1552; Manufacturer: Murata Electronics North America; Manufacturer Part Number: GRM155R71C104KA88D; Capacitance: 0.10µF; Tolerance: ±10%; Voltage - Rated: 16V; Temperature Coefficient: X7R; Supplier 1: Digi-Key; RoHS: RoHS Compliant; Category: Capacitors; Stock 1: 22029292; Pricing 1: 1=0.1, 10=0.012, 50=0.0066, 100=0.0055, 250=0.00452, 500=0.00386, 1000=0.003, 5000=0.0025 (USD); Packaging: Cut Tape (CT); Mounting Type: Surface Mount, MLCC; Operating Temperature: -55°C ~ 125°C; Applications: General Purpose; Ratings: -; Package / Case: 0402 (1005 Metric); Size / Dimension: 0.039" L x 0.020" W (1.00mm x 0.50mm); Height - Seated (Max): -; Thickness (Max): 0.022" (0.55mm); Lead Spacing: -; Features: -; Lead Style: -; ComponentLink1URL: http://www.murata.com/~/media/webrenewal/support/library/catalog/products/capacitor/mlcc/c02e.pdf; ComponentLink1Description: http://www.murata.com/~/media/webrenewal/support/library/catalog/products/capacitor/mlcc/c02e.pdf; Supplier Part Number 1: 490-3261-1-ND; Part Status: Active
D1 = DIODE_SOT23: Dán; Ten_Linh_Kien: A1015 SOT23 TRANS PNP 0.15A 50V ( SMD-BA); Ma_Hang: MH001957; Don_Vi: Con; Chung_Loai: Dán
FB1 L1-L5 L7 L8 L10-L13 L17 = FB SMD 0402: C76882 Extend; Manufacturer: Murata Electronics North America; Manufacturer Part Number: BLM15AG102SN1D; Number of Lines: 1; Impedance @ Frequency: 1 kOhm @ 100MHz; Current Rating (Max): 300mA; DC Resistance (DCR) (Max): 650 mOhm; Supplier 1: Digi-Key; RoHS: RoHS Compliant; Category: Filters; Stock 1: 162881; Pricing 1: 1=0.1, 10=0.084, 50=0.0688, 100=0.0505, 250=0.03668, 500=0.03364, 1000=0.02905, 5000=0.02294 (USD); Packaging: Cut Tape (CT); Part Status: Active; Filter Type: -; Ratings: -; Operating Temperature: -55°C ~ 125°C; Package / Case: 0402 (1005 Metric); Mounting Type: Surface Mount; Height (Max): 0.022" (0.55mm); Size / Dimension: 0.039" L x 0.020" W (1.00mm x 0.50mm); ComponentLink1URL: http://search.murata.co.jp/Ceramy/image/img/PDF/ENG/L0110S0100BLM15AG_SN.pdf; ComponentLink1Description: http://search.murata.co.jp/Ceramy/image/img/PDF/ENG/L0110S0100BLM15AG_SN.pdf; Supplier Part Number 1: 490-1007-1-ND
HP_OUT = Header 3P: Cắm; Ma_Hang: *; Ghi_Chu: *; Don_Vi: *; Kieu_Chan: *; Chung_Loai: Cắm
J3 = FM/DAB: Jac Video Stereo
J4 = AXIAL: Jac Video Stereo
J10 = Header 2P: Cắm; Chung_Loai: Cắm
J14 J? = CON FPC/FFC 0.5mm 34P horizontal: Manufacturer Part Number: CON FPC/FFC 0.5mm 18P VERTICAL; Manufacturer: CHINA
J16 = JP4: WR-PHD 2.54 mm Angled Socket Header; Manufacturer: W¨¹rth Elektronik eiSos GmbH; partNo: 613004143121; ComponentLink1 Description: Manufacturer; ComponentLink2 Description: Datasheet; NoPins: 04; Created Date: 29 March 2013; ComponentLink1URL: http://www.we-online.com; ComponentLink2URL: http://katalog.we-online.de/em/datasheet/6130xx143121.pdf; Created by: Karrer Zheng
JDC = Jac_DC: Cắm; Ten_Linh_Kien: Jack DC5.5x2.1MM DC5501; Ma_Hang: MH000923; Don_Vi: Con; Kieu_Chan: *; Ghi_Chu: *; Chung_Loai: Cắm
L6 R1 R2 R3#1 R3#2 R4-R24 R25#1 R25#2 R27-R30 R32-R42 R43#1 R43#2 R44-R48 R50 R51 R53-R57 R59-R79 R85 = RES 10K 0402 1%: RES SMD 10K OHM 1% 1/16W 0402; Manufacturer: Vishay Dale; Manufacturer Part Number: CRCW040210K0FKED; Power (Watts): 0.063W, 1/16W; Temperature Coefficient: ±100ppm/°C; Supplier 1: Digi-Key; RoHS: RoHS Compliant; Category: Resistors; Stock 1: 2392462; Pricing 1: 10=0.083, 50=0.0444, 200=0.0255, 1000=0.0174 (USD); Packaging: Cut Tape (CT); Resistance (Ohms): 10k; Tolerance: ±1%; Composition: Thick Film; Features: Automotive AEC-Q200; Operating Temperature: -55°C ~ 155°C; Package / Case: 0402 (1005 Metric); Supplier Device Package: 0402 (1005 Metric); Size / Dimension: 0.039" L x 0.020" W (1.00mm x 0.50mm); Height: 0.016" (0.40mm); Number of Terminations: 2; ComponentLink1URL: http://www.vishay.com/docs/20035/dcrcwe3.pdf; ComponentLink1Description: http://www.vishay.com/docs/20035/dcrcwe3.pdf; Supplier Part Number 1: 541-10.0KLCT-ND
L20 L23-L31 = Tro 0603 1% 0R: C21189; Chung_Loai: Dán; Don_Vi: Con; So_Chan: 2; Ten_Linh_Kien: Trở 0603 1% 0R; Ma_Hang: MH005792; Kieu_Chan: *
L21 = 1.8nH: C251961 extend; BOM_Manufacturer: EMTEK; BOM_Manufacturer Part: HSC0603-1N8J-T; nameAlias: Inductance; Contributor: LCSC; BOM_Supplier: LCSC; BOM_Supplier Part: C251772; spicePre: L; spiceSymbolName: HSC0603-1N8J-T
L?#1 L?#2 = CUON CAM 47uH_ SMD: Dán; Don_Vi: Con; Ma_Hang: MH004211; Ten_Linh_Kien: Cuộn Cảm 47uH 7x7x4MM CD74R; Ghi_Chu: *; Kieu_Chan: *; Chung_Loai: Dán
L?#3 = CUON CAM LOC: Value: Loc 220; Designed by: VanDungEvn
Q1 = IRF MOSFET BSS84: Ten_Linh_Kien: BSS84 PD; Ma_Hang: MH001957; Don_Vi: Con; Chung_Loai: Dán
Q2 Q4 Q5 Q7 = TRANS NPN: NPN; MMBTA42: 300V-NPN
Q3 Q6 = IRF MOSFET BSS84: FDN340P; Ten_Linh_Kien: BSS84 PD; Ma_Hang: MH001957; Don_Vi: Con; Chung_Loai: Dán
RJ45 = JR45-ethernet
U1 = OPTICAL TORX147L
U12 = PSRAM-LY68L6400S: PSRAM-3V3 FOR ESP32; MANUFACTURER: CHINA; Manufacturer Part Number: PSRAM-3V3
U13 = SOT23 RESET IC MAX803: MAX803/MAX809/ / MAX810; Ten_Linh_Kien: C1815 SOT23 TRANS NPN 0.15A 50V (SMD-HF); Don_Vi: Con; Ma_Hang: MH000946; Chung_Loai: Dán; Ghi_Chu: *; Kieu_Chan: *
U14 = CJA 3.3V: Dán; Don_Vi: Con; Ten_Linh_Kien: CJA1117B-3.3 SOT89 IC Nguồn 1A 3.3V; Ma_Hang: MH006129; Kieu_Chan: *; Ghi_Chu: *; Chung_Loai: Dán
U15 = ESP32-PICO-D4: ESP32-D0WDQ6-V3-ESP32-PICO-D4; BOM_Manufacturer: Espressif Systems; Contributor: LCSC; BOM_Supplier: LCSC; BOM_Supplier Part: C193707; BOM_Manufacturer Part: ESP32-PICO-D4; spicePre: U; spiceSymbolName: ESP32-PICO-D4
U16 = W25Q80DLSNIG: C2641267; BOM_Manufacturer: Winbond Elec; BOM_Manufacturer Part: W25Q80DVSNIG; Contributor: Herbert Boks; BOM_Supplier: LCSC; BOM_Supplier Part: C115408; spicePre: U; spiceSymbolName: W25Q80DLSNIG
X1 X2 X7 Y1 = 40MHz: C295515 extend; BOM_Manufacturer: TAITIEN Elec; BOM_Manufacturer Part: OVETGLJANF-40MHZ; nameAlias: Frequency; Contributor: LCSC; BOM_Supplier: LCSC; BOM_Supplier Part: C295515; BOM_LCSC Assembly: Yes; SMT Type: Extend; spicePre: X; spiceSymbolName: OVETGLJANF-40MHZ